# Altium schematic sheet Schéma principe MUX LEDS.SchDoc
size A4
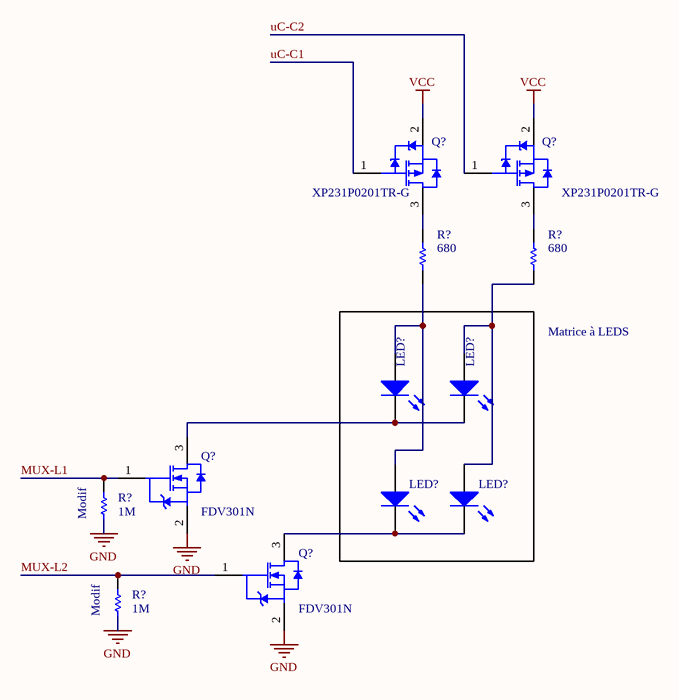
[diagram p0: Schéma principe MUX LEDS.SchDoc]

## Parts
(Parts that share a designator on the sheet are numbered #1, #2 ... from top to bottom, then left to right.)
LED?#1  APTD2012LSURCK  [0805_LED]  (value not drawn)
LED?#2  APTD2012LSURCK  [0805_LED]  (value not drawn)
LED?#3  APTD2012LSURCK  [0805_LED]  (value not drawn)
LED?#4  APTD2012LSURCK  [0805_LED]  (value not drawn)
Q?#1  XP231P0201TR-G  [FAIR-SOT23-3_V]
Q?#2  XP231P0201TR-G  [FAIR-SOT23-3_V]
Q?#3  FDV301N  [FAIR-SOT23-3_V]
Q?#4  FDV301N  [FAIR-SOT23-3_V]
R?#1  680  [RESC0805(2012)_L]
R?#2  680  [RESC0805(2012)_L]
R?#3  1M  [RESC0805(2012)_L]
R?#4  1M  [RESC0805(2012)_L]

## Nets
GND: Q?#3.2(S) Q?#4.2(S) R?#3.1 R?#4.1
VCC: Q?#1.2(S) Q?#2.2(S)
MUX-L1: Q?#3.1(G) R?#3.2
MUX-L2: Q?#4.1(G) R?#4.2
uC-C1: Q?#1.1(G)
uC-C2: Q?#2.1(G)
NetLED?#1_1: LED?#1.1(K) LED?#2.1(K) Q?#3.3(D)
NetLED?#1_2: LED?#1.2(A) LED?#3.2(A) R?#1.1
NetLED?#2_2: LED?#2.2(A) LED?#4.2(A) R?#2.1
NetLED?#3_1: LED?#3.1(K) LED?#4.1(K) Q?#4.3(D)
NetQ?#1_3: Q?#1.3(D) R?#1.2
NetQ?#2_3: Q?#2.3(D) R?#2.2

## Notes on the sheet
- Matrice à LEDS
- (near R?#3) Modif
- (near R?#4) Modif

## Library data of the parts
Q?#1 Q?#2 = Mosfet P
Q?#3 Q?#4 = NEMOS-GSD-3_D: Supplier 1: Mouser; Supplier Part Number 1: FDV301N
R?#1-R?#4 = RES
LED?#1-LED?#4 = APTD2012LSURCK: Supplier 1: Mouser